# EAGLE design lesion-breakout (EAGLE 8.3.2)
DESIGNER: JON NEWMAN; DESIGN_NAME: lesion-64-128-256; LICENSE: CERN OHL v1.2; REVISION: 1.0
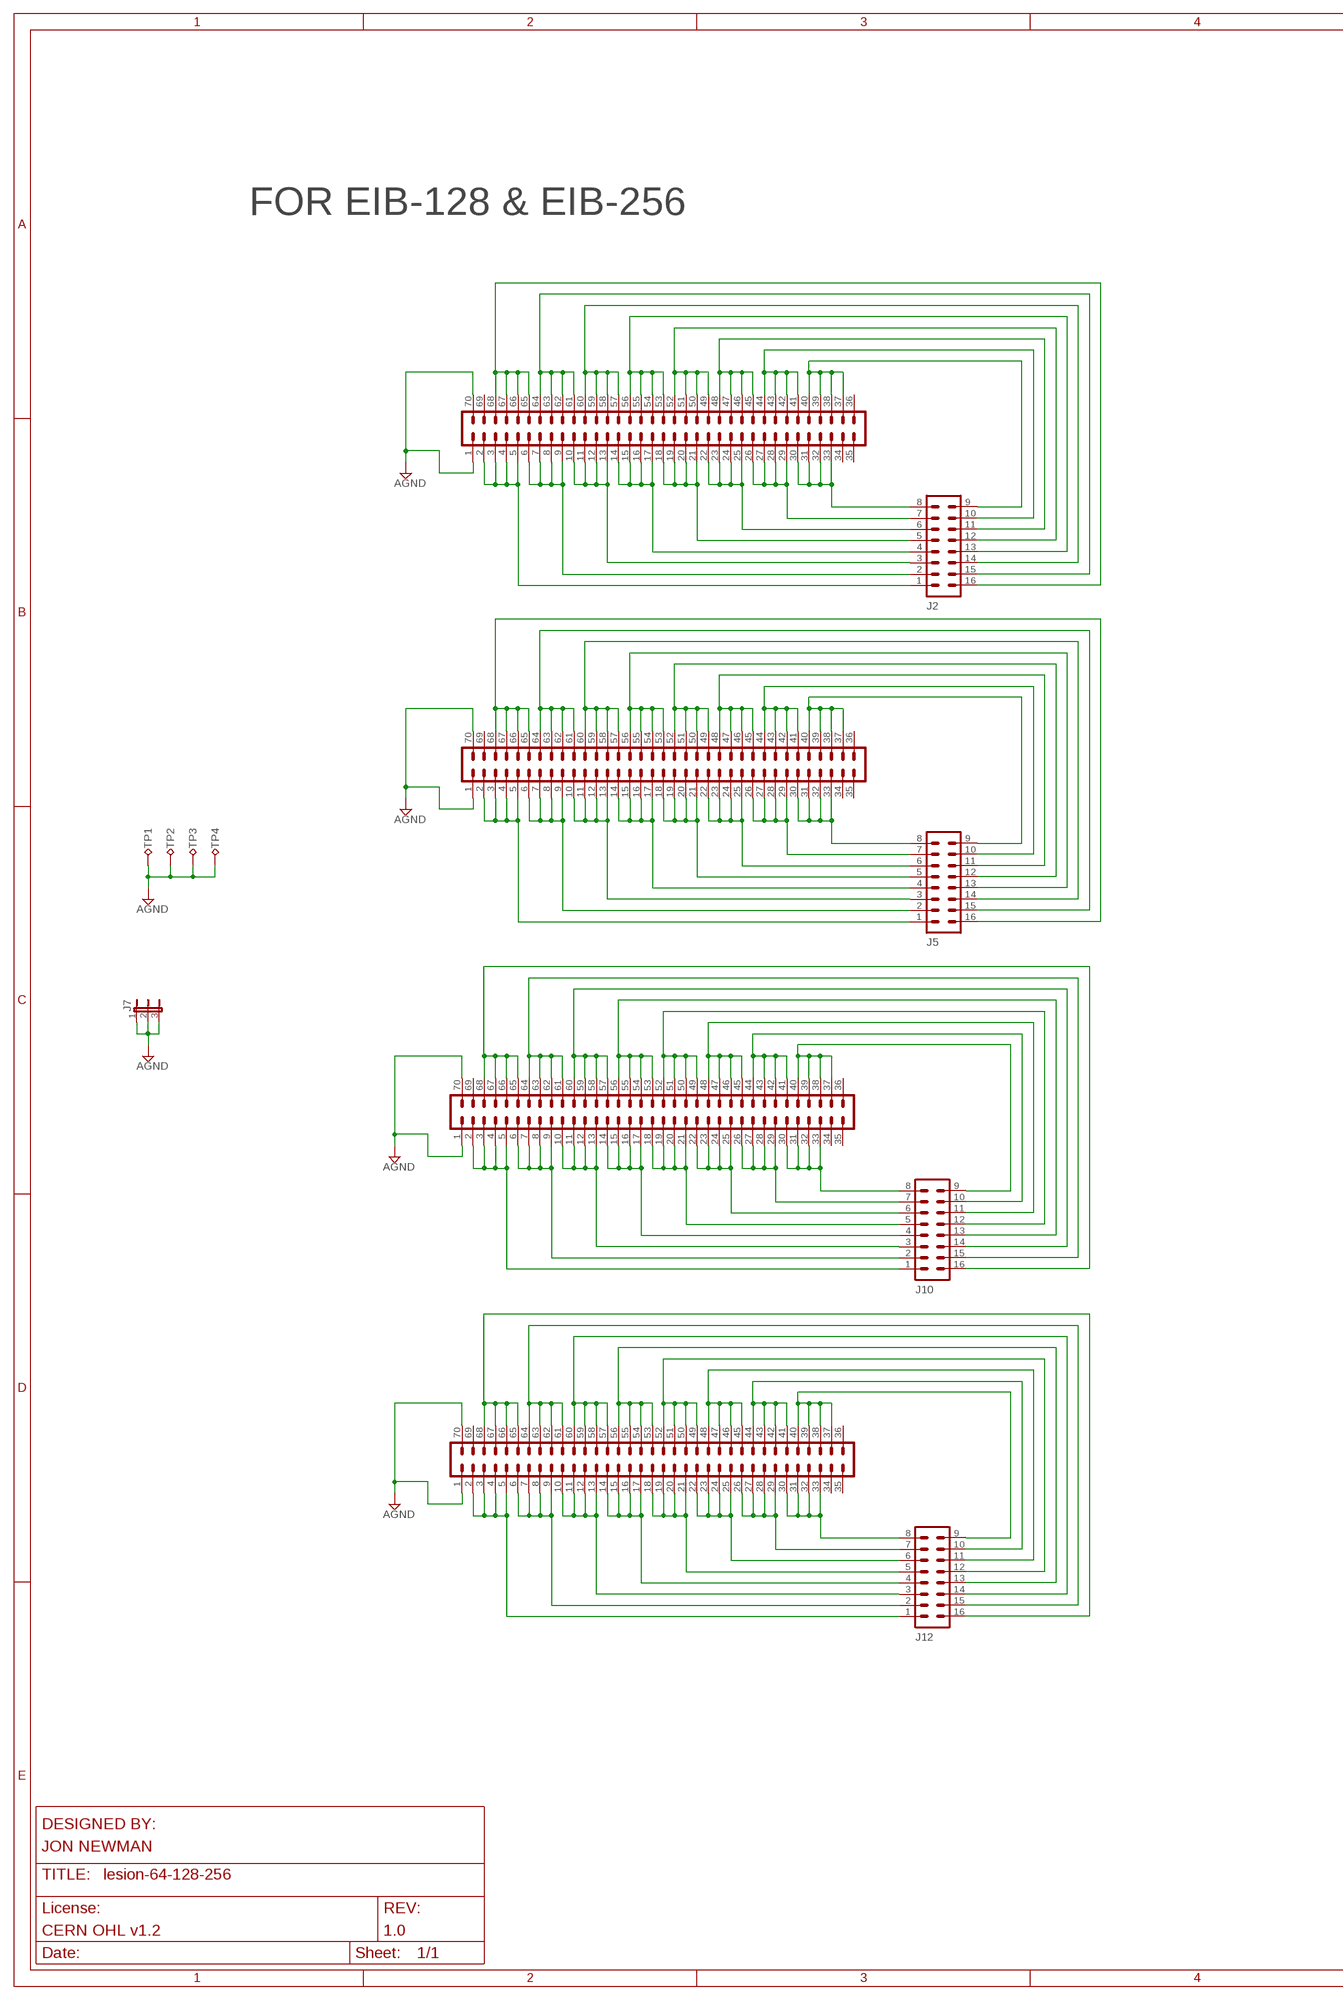
[diagram p0: schematic, sheet 1, part 1 of 3]
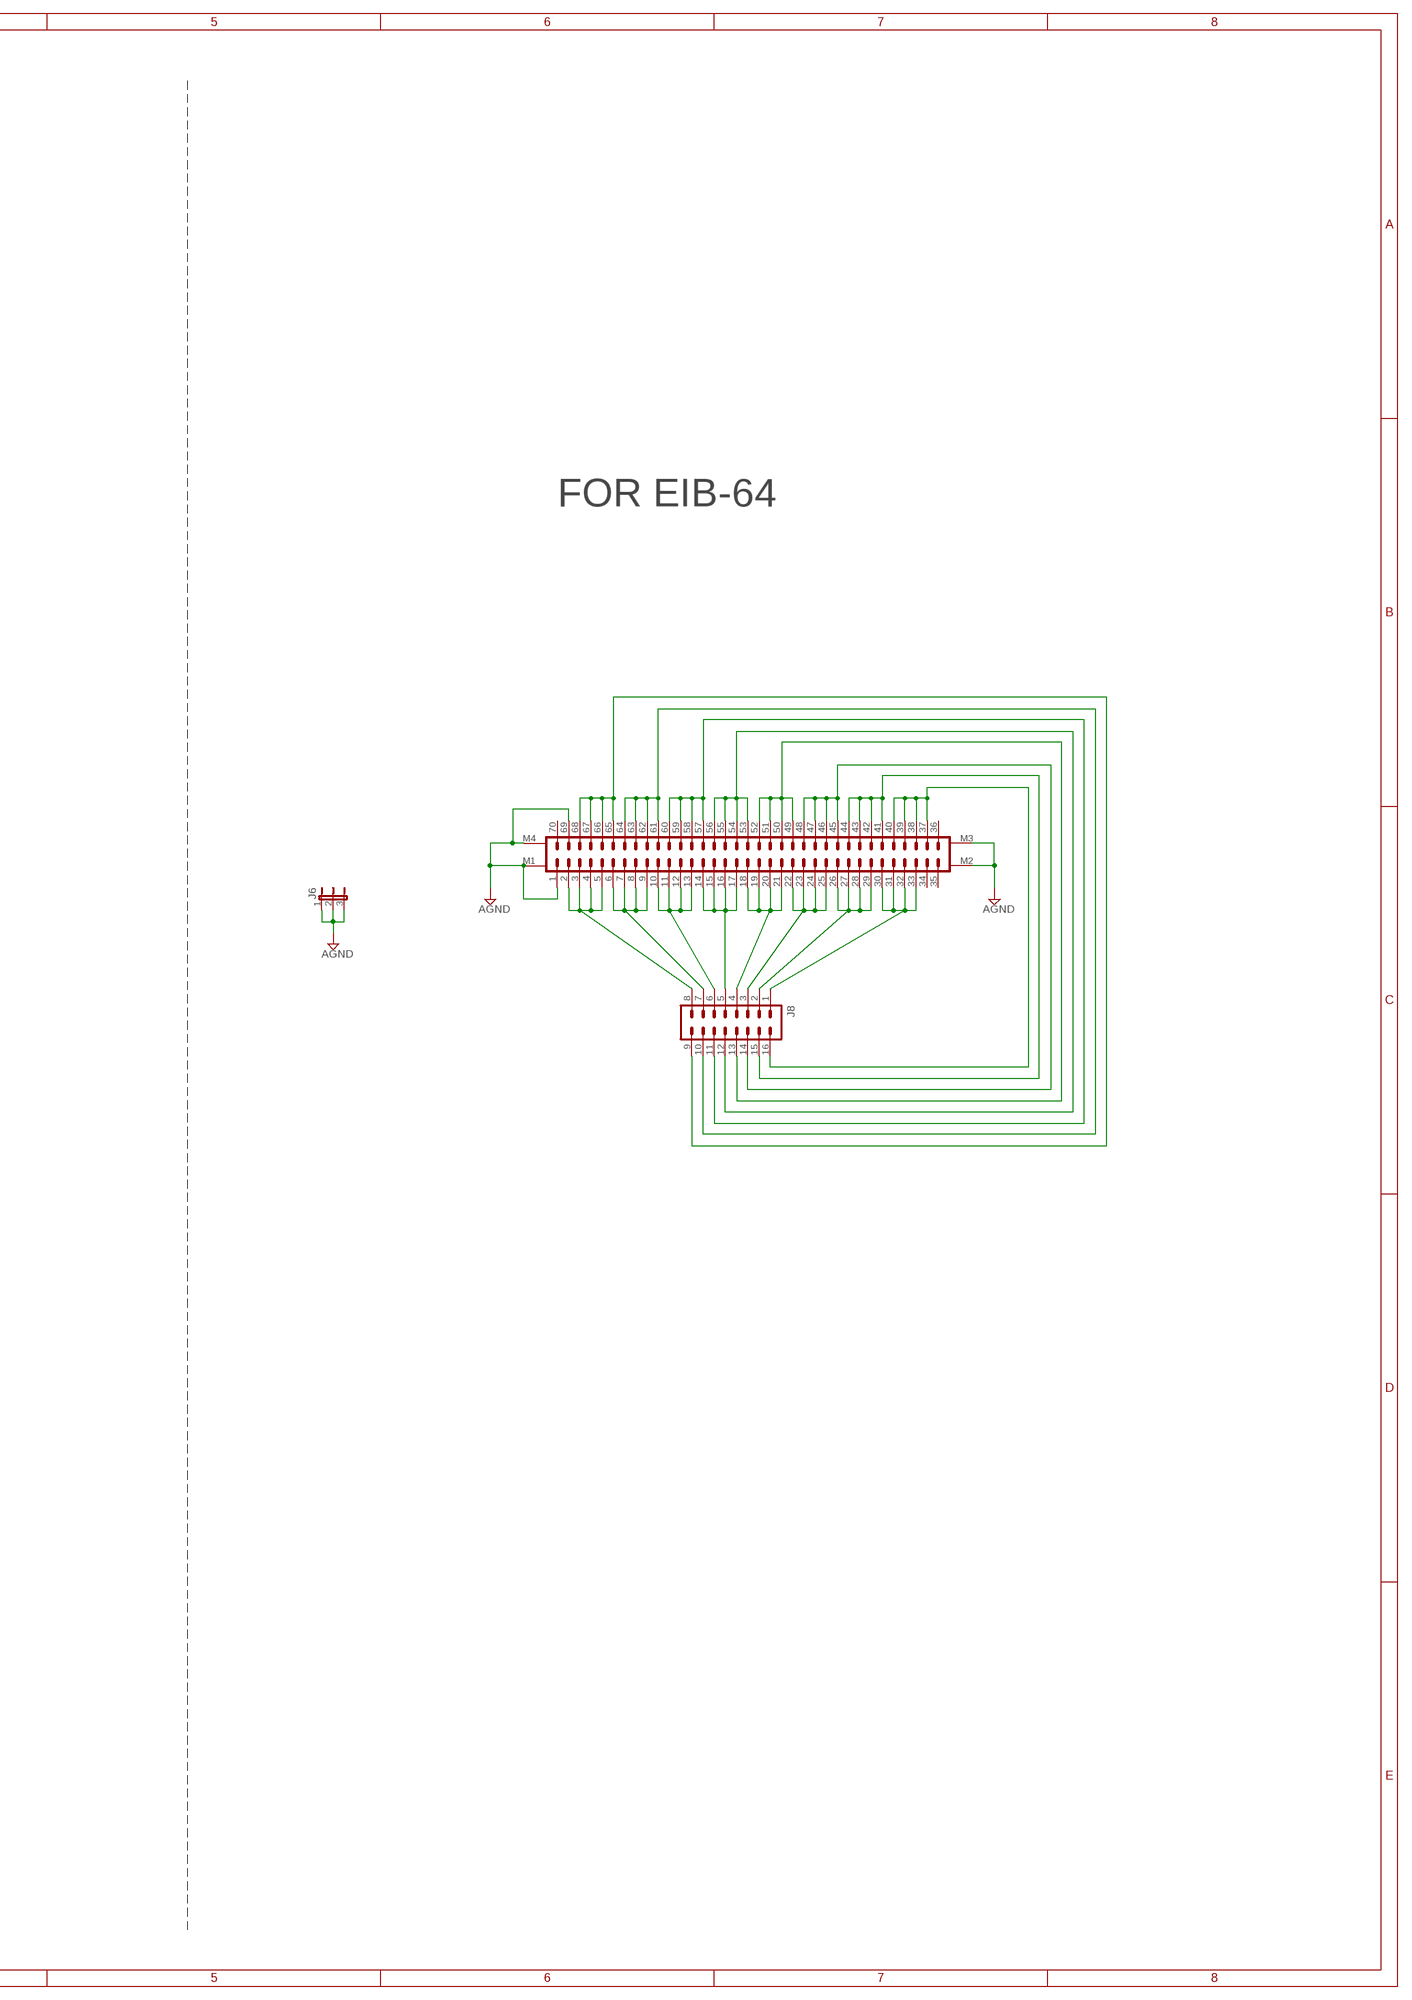
[diagram p1: schematic, sheet 1, part 2 of 3]
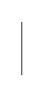
[diagram p2: schematic, sheet 1, part 3 of 3]

## Parts
J1  DF40C(2.0)-70DS-0.4V(51)  PINHD-2X35_DF40REC  [DF40-70REC]
J2  PINHD-2X8_SMD_0.5"  [JP2X8_SMD_0.5"]
J3  DF40C(2.0)-70DS-0.4V(51)  PINHD-2X35_DF40REC  [DF40-70REC]
J4  DF40C-70DP-0.4V(51)  PINHD-2X35+4DF40-70HEAD-LESS-SILK  [DF40-70HEAD-LESS-SILK]
J5  PINHD-2X8_SMD_0.5"  [JP2X8_SMD_0.5"]
J6  JP3E_SMD-0.05  [JP3_SMD-0.05]
J7  JP3E_SMD-0.05  [JP3_SMD-0.05]
J8  PINHD-2X8_SMD_0.5"  [JP2X8_SMD_0.5"]
J9  DF40C(2.0)-70DS-0.4V(51)  PINHD-2X35_DF40REC  [DF40-70REC]
J10  PINHD-2X8_SMD_0.5"  [JP2X8_SMD_0.5"]
J11  DF40C(2.0)-70DS-0.4V(51)  PINHD-2X35_DF40REC  [DF40-70REC]
J12  PINHD-2X8_SMD_0.5"  [JP2X8_SMD_0.5"]
TP1  TP_1MM  [TESTPOINT_1MM]
TP2  TP_1MM  [TESTPOINT_1MM]
TP3  TP_1MM  [TESTPOINT_1MM]
TP4  TP_1MM  [TESTPOINT_1MM]

## Nets
AGND: J1.1 J1.70 J3.1 J3.70 J4.1 J4.69 J4.M1 J4.M2 J4.M3 J4.M4 J6.1 J6.2 J6.3 J7.1 J7.2 J7.3 J9.1 J9.70 J11.1 J11.70 TP1.1(TP) TP2.1(TP) TP3.1(TP) TP4.1(TP)
N$1: J4.53 J4.54 J4.55 J4.56 J8.12
N$2: J4.57 J4.58 J4.59 J4.60 J8.11
N$3: J4.61 J4.62 J4.63 J4.64 J8.10
N$4: J4.2 J4.3 J4.4 J4.5 J8.8
N$5: J4.65 J4.66 J4.67 J4.68 J8.9
N$6: J4.10 J4.11 J4.12 J4.13 J8.6
N$7: J4.14 J4.15 J4.16 J4.17 J8.5
N$8: J4.18 J4.19 J4.20 J4.21 J8.4
N$9: J4.22 J4.23 J4.24 J4.25 J8.3
N$10: J4.26 J4.27 J4.28 J4.29 J8.2
N$11: J4.30 J4.31 J4.32 J4.33 J8.1
N$12: J4.37 J4.38 J4.39 J4.40 J8.16
N$13: J4.41 J4.42 J4.43 J4.44 J8.15
N$14: J4.45 J4.46 J4.47 J4.48 J8.14
N$15: J4.49 J4.50 J4.51 J4.52 J8.13
N$32: J4.6 J4.7 J4.8 J4.9 J8.7
N$33: J1.2 J1.3 J1.4 J1.5 J2.1
N$34: J1.6 J1.7 J1.8 J1.9 J2.2
N$35: J1.10 J1.11 J1.12 J1.13 J2.3
N$36: J1.14 J1.15 J1.16 J1.17 J2.4
N$37: J1.18 J1.19 J1.20 J1.21 J2.5
N$38: J1.22 J1.23 J1.24 J1.25 J2.6
N$39: J1.26 J1.27 J1.28 J1.29 J2.7
N$40: J1.30 J1.31 J1.32 J1.33 J2.8
N$41: J1.37 J1.38 J1.39 J1.40 J2.9
N$42: J1.41 J1.42 J1.43 J1.44 J2.10
N$43: J1.45 J1.46 J1.47 J1.48 J2.11
N$44: J1.49 J1.50 J1.51 J1.52 J2.12
N$45: J1.53 J1.54 J1.55 J1.56 J2.13
N$46: J1.57 J1.58 J1.59 J1.60 J2.14
N$47: J1.61 J1.62 J1.63 J1.64 J2.15
N$48: J1.65 J1.66 J1.67 J1.68 J2.16
N$49: J3.2 J3.3 J3.4 J3.5 J5.1
N$50: J3.6 J3.7 J3.8 J3.9 J5.2
N$51: J3.10 J3.11 J3.12 J3.13 J5.3
N$52: J3.14 J3.15 J3.16 J3.17 J5.4
N$53: J3.18 J3.19 J3.20 J3.21 J5.5
N$54: J3.22 J3.23 J3.24 J3.25 J5.6
N$55: J3.26 J3.27 J3.28 J3.29 J5.7
N$56: J3.30 J3.31 J3.32 J3.33 J5.8
N$57: J3.37 J3.38 J3.39 J3.40 J5.9
N$58: J3.41 J3.42 J3.43 J3.44 J5.10
N$59: J3.45 J3.46 J3.47 J3.48 J5.11
N$60: J3.49 J3.50 J3.51 J3.52 J5.12
N$61: J3.53 J3.54 J3.55 J3.56 J5.13
N$62: J3.57 J3.58 J3.59 J3.60 J5.14
N$63: J3.61 J3.62 J3.63 J3.64 J5.15
N$64: J3.65 J3.66 J3.67 J3.68 J5.16
N$81: J9.2 J9.3 J9.4 J9.5 J10.1
N$82: J9.6 J9.7 J9.8 J9.9 J10.2
N$83: J9.10 J9.11 J9.12 J9.13 J10.3
N$84: J9.14 J9.15 J9.16 J9.17 J10.4
N$85: J9.18 J9.19 J9.20 J9.21 J10.5
N$86: J9.22 J9.23 J9.24 J9.25 J10.6
N$87: J9.26 J9.27 J9.28 J9.29 J10.7
N$88: J9.30 J9.31 J9.32 J9.33 J10.8
N$89: J9.37 J9.38 J9.39 J9.40 J10.9
N$90: J9.41 J9.42 J9.43 J9.44 J10.10
N$91: J9.45 J9.46 J9.47 J9.48 J10.11
N$92: J9.49 J9.50 J9.51 J9.52 J10.12
N$93: J9.53 J9.54 J9.55 J9.56 J10.13
N$94: J9.57 J9.58 J9.59 J9.60 J10.14
N$95: J9.61 J9.62 J9.63 J9.64 J10.15
N$96: J9.65 J9.66 J9.67 J9.68 J10.16
N$113: J11.2 J11.3 J11.4 J11.5 J12.1
N$114: J11.6 J11.7 J11.8 J11.9 J12.2
N$115: J11.10 J11.11 J11.12 J11.13 J12.3
N$116: J11.14 J11.15 J11.16 J11.17 J12.4
N$117: J11.18 J11.19 J11.20 J11.21 J12.5
N$118: J11.22 J11.23 J11.24 J11.25 J12.6
N$119: J11.26 J11.27 J11.28 J11.29 J12.7
N$120: J11.30 J11.31 J11.32 J11.33 J12.8
N$121: J11.37 J11.38 J11.39 J11.40 J12.9
N$122: J11.41 J11.42 J11.43 J11.44 J12.10
N$123: J11.45 J11.46 J11.47 J11.48 J12.11
N$124: J11.49 J11.50 J11.51 J11.52 J12.12
N$125: J11.53 J11.54 J11.55 J11.56 J12.13
N$126: J11.57 J11.58 J11.59 J11.60 J12.14
N$127: J11.61 J11.62 J11.63 J11.64 J12.15
N$128: J11.65 J11.66 J11.67 J11.68 J12.16
Unconnected: J1.34 J1.35 J1.36 J1.69 J3.34 J3.35 J3.36 J3.69 J4.34 J4.35 J4.36 J4.70 J9.34 J9.35 J9.36 J9.69 J11.34 J11.35 J11.36 J11.69

## Notes on the sheet
- FOR EIB-128 & EIB-256
- FOR EIB-64

## Library data of the parts
J1 J3 J9 J11 = jonnew:PINHD-2X35
J2 J5 J8 J10 J12 = jonnew:PINHD-2X8
J4 = jonnew:PINHD-2X35+4
J6 J7 = jonnew:JP3E
TP1-TP4 = jonnew:TP: Test pad

## Net classes
1 thick: width 0.102 mm

## Board
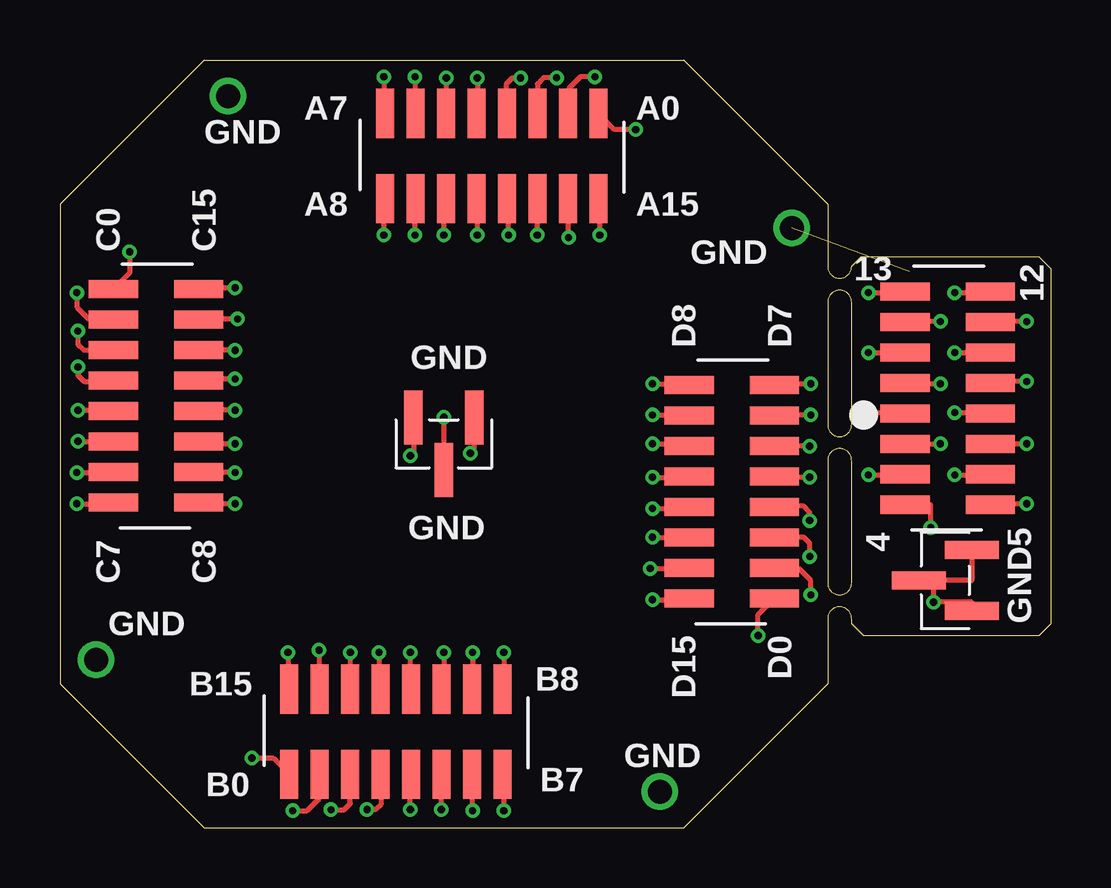
[diagram p3: board, top side]
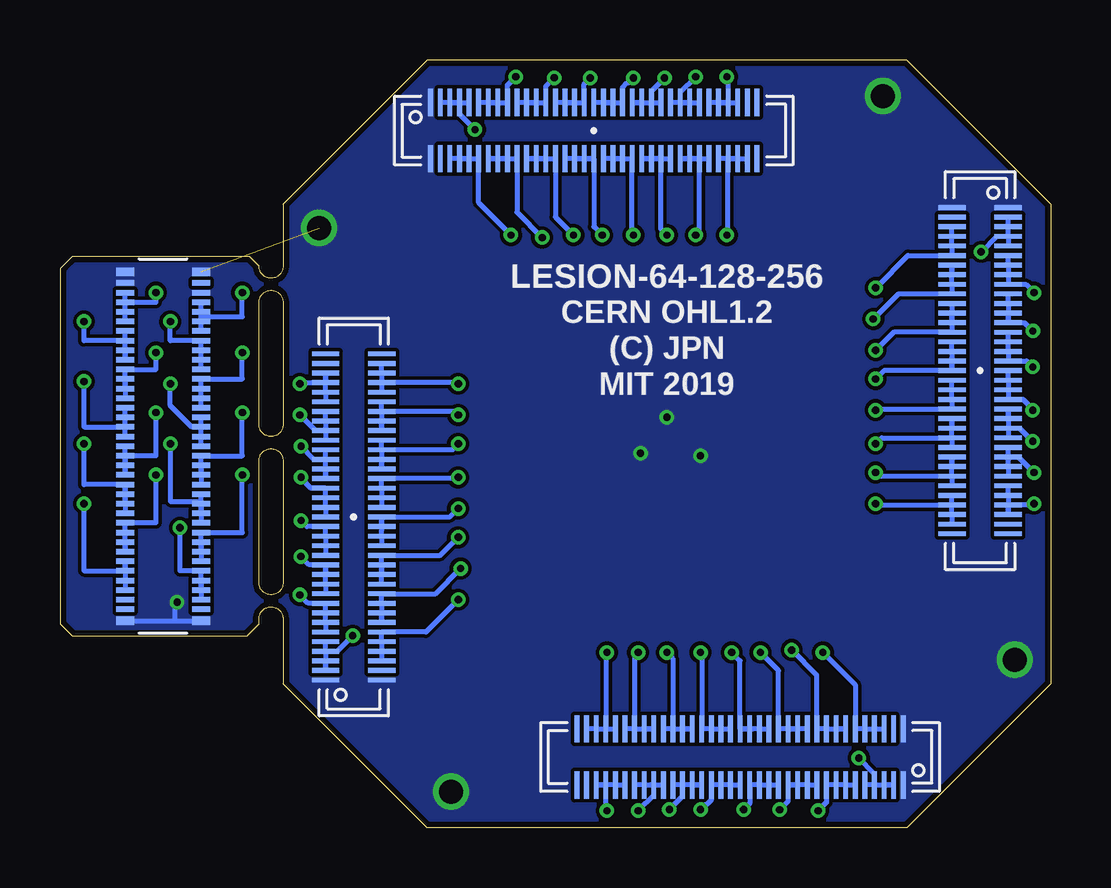
[diagram p4: board, bottom side, seen from below]

Size 41.3 x 32 mm. Coordinates in mm from the lower left corner, seen from the top.
Outline: 32,26 26,32 6,32 0,26 0,6 6,0 26,0 32,6 32,8.7 arc-90 32.5,9.2 arc-90 33,8.7 33,8.5 33.5,8 40.8,8 41.3,8.5 41.3,23.3 40.8,23.8 33.4,23.8 33,23.4 arc-90 32.5,22.9 arc-90 32,23.4 32,26
Outline: 33,21.9 arc90 32.5,22.4 arc90 32,21.9 32,16.8 arc90 32.5,16.3 arc90 33,16.8 33,21.9
Outline: 33,15.3 arc90 32.5,15.8 arc90 32,15.3 32,10.2 arc90 32.5,9.7 arc90 33,10.2 33,15.3
Copper layers (1*16): Top 0.035mm / dielectric 1.5mm / Bottom 0.035mm
Design rules "seeed-studio-2-layer *": minimum track width 6mil, minimum drill 0.3mm, track to track 6mil, track to pad 6mil, pad to pad 6mil, via to via 6mil, smd to smd 0mil, copper to edge 10mil, drill to drill 10mil, minimum pad ring 10mil, minimum via ring 6mil, stop-mask expansion 2mil, vias tented up to drill 100mil, thermal gap 10mil

### Footprints (pad centres in the part's own frame; a part is rotated, then mirrored left to right if it is on the bottom)
DF40-70REC = smd 0.2 x 1.14: 1 -6.8,1.17; 2 -6.4,1.17; 3 -6,1.17; 4 -5.6,1.17; 5 -5.2,1.17; 6 -4.8,1.17; 7 -4.4,1.17; 8 -4,1.17; 9 -3.6,1.17; 10 -3.2,1.17; 11 -2.8,1.17; 12 -2.4,1.17; 13 -2,1.17; 14 -1.6,1.17; 15 -1.2,1.17; 16 -0.8,1.17; 17 -0.4,1.17; 18 0,1.17; 19 0.4,1.17; 20 0.8,1.17; 21 1.2,1.17; 22 1.6,1.17; 23 2,1.17; 24 2.4,1.17; 25 2.8,1.17; 26 3.2,1.17; 27 3.6,1.17; 28 4,1.17; 29 4.4,1.17; 30 4.8,1.17; 31 5.2,1.17; 32 5.6,1.17; 33 6,1.17; 34 6.4,1.17; 35 6.8,1.17; 36 6.8,-1.17; 37 6.4,-1.17; 38 6,-1.17; 39 5.6,-1.17; 40 5.2,-1.17; 41 4.8,-1.17; 42 4.4,-1.17; 43 4,-1.17; 44 3.6,-1.17; 45 3.2,-1.17; 46 2.8,-1.17; 47 2.4,-1.17; 48 2,-1.17; 49 1.6,-1.17; 50 1.2,-1.17; 51 0.8,-1.17; 52 0.4,-1.17; 53 0,-1.17; 54 -0.4,-1.17; 55 -0.8,-1.17; 56 -1.2,-1.17; 57 -1.6,-1.17; 58 -2,-1.17; 59 -2.4,-1.17; 60 -2.8,-1.17; 61 -3.2,-1.17; 62 -3.6,-1.17; 63 -4,-1.17; 64 -4.4,-1.17; 65 -4.8,-1.17; 66 -5.2,-1.17; 67 -5.6,-1.17; 68 -6,-1.17; 69 -6.4,-1.17; 70 -6.8,-1.17
JP2X8_SMD_0.5" = smd 0.76 x 2.05: 1 -4.445,-1.775; 2 -3.175,-1.775; 3 -1.905,-1.775; 4 -0.635,-1.775; 5 0.635,-1.775; 6 1.905,-1.775; 7 3.175,-1.775; 8 4.445,-1.775; 9 4.445,1.775; 10 3.175,1.775; 11 1.905,1.775; 12 0.635,1.775; 13 -0.635,1.775; 14 -1.905,1.775; 15 -3.175,1.775; 16 -4.445,1.775
DF40-70HEAD-LESS-SILK = smd 0.23 x 0.75: 1 -6.8,-1.585; 2 -6.4,-1.585; 3 -6,-1.585; 4 -5.6,-1.585; 5 -5.2,-1.585; 6 -4.8,-1.585; 7 -4.4,-1.585; 8 -4,-1.585; 9 -3.6,-1.585; 10 -3.2,-1.585; 11 -2.8,-1.585; 12 -2.4,-1.585; 13 -2,-1.585; 14 -1.6,-1.585; 15 -1.2,-1.585; 16 -0.8,-1.585; 17 -0.4,-1.585; 18 0,-1.585; 19 0.4,-1.585; 20 0.8,-1.585; 21 1.2,-1.585; 22 1.6,-1.585; 23 2,-1.585; 24 2.4,-1.585; 25 2.8,-1.585; 26 3.2,-1.585; 27 3.6,-1.585; 28 4,-1.585; 29 4.4,-1.585; 30 4.8,-1.585; 31 5.2,-1.585; 32 5.6,-1.585; 33 6,-1.585; 34 6.4,-1.585; 35 6.8,-1.585; 36 6.8,1.585; 37 6.4,1.585; 38 6,1.585; 39 5.6,1.585; 40 5.2,1.585; 41 4.8,1.585; 42 4.4,1.585; 43 4,1.585; 44 3.6,1.585; 45 3.2,1.585; 46 2.8,1.585; 47 2.4,1.585; 48 2,1.585; 49 1.6,1.585; 50 1.2,1.585; 51 0.8,1.585; 52 0.4,1.585; 53 0,1.585; 54 -0.4,1.585; 55 -0.8,1.585; 56 -1.2,1.585; 57 -1.6,1.585; 58 -2,1.585; 59 -2.4,1.585; 60 -2.8,1.585; 61 -3.2,1.585; 62 -3.6,1.585; 63 -4,1.585; 64 -4.4,1.585; 65 -4.8,1.585; 66 -5.2,1.585; 67 -5.6,1.585; 68 -6,1.585; 69 -6.4,1.585; 70 -6.8,1.585 | smd 0.35 x 0.75: M1 -7.275,-1.585; M2 7.275,-1.585; M3 7.275,1.585; M4 -7.275,1.585
JP3_SMD-0.05 = smd 0.76 x 2.25: 1 -1.27,1.1; 2 0,-1.1; 3 1.27,1.1
TESTPOINT_1MM = drill 1: 1 0,0

### Placement (x,y rotation side)
J1  19.05,29.05 0 bottom
J2  18,28 180 top
J3  2.95,19.05 270 bottom
J4  37,15.9 270 bottom
J5  4,18 270 top
J6  36.9,10.3 270 top
J7  16,16 0 top
J8  37,17.9 90 top
J9  12.95,2.95 180 bottom
J10  14,4 0 top
J11  29.05,12.95 90 bottom
J12  28,14 90 top
TP1  1.5,7 0 top
TP2  7,30.5 0 top
TP3  30.5,25 0 top
TP4  25,1.5 0 top

### Tracks (layer width: path | path; a pad name or v marks a point on that pad's centre or on a via)
AGND  (via drill 0.3)  (1 unrouted)
  Top 0.2: J7.2 v16,17.1 | J7.1 14.73,15.63 v14.6,15.5 | J7.3 17.27,15.77 v17.1,15.6 | J6.3 38,9.4 v36.42,9.4 36.42,10.3 | 36.42,10.3 J6.2 | J6.1 38,10.3 36.42,10.3
  Bottom 0.2: J4.M2 J4.M3 | 36.5,8.62 36.5,9.4 v36.42,9.4
  pour Bottom (no thermals): -11.7,42.3 51.3,42.3 51.3,-19 -12,-19
N$1  (via drill 0.3)
  Top 0.2: v36.7,18.5 35.23,18.5 J8.12
  Bottom 0.2: v36.7,18.5 36.7,17.59 35.81,16.7 J4.55 | J4.53 35.41,16.6 | J4.55 J4.56 | J4.54 35.41,16.6 | 35.41,16.6 J4.55
N$2  (via drill 0.3)
  Top 0.2: v33.7,19.8 J8.11
  Bottom 0.2: v33.7,19.8 33.7,18.7 J4.60 J4.59 J4.58 J4.57
N$3  (via drill 0.3)
  Top 0.2: v36.7,21.1 35.23,21.1 J8.10
  Bottom 0.2: v36.7,21.1 36.7,20.3 J4.64 J4.63 J4.62 J4.61
N$4  (via drill 0.3)
  Top 0.2: v37.3,22.3 38.77,22.3 J8.8
  Bottom 0.2: J4.3 J4.4 J4.5 | J4.3 J4.2 | J4.3 37.3,21.9 v37.3,22.3
N$5  (via drill 0.3)
  Top 0.2: v33.7,22.3 35.23,22.3 J8.9
  Bottom 0.2: J4.65 35.41,21.3 | 35.41,21.4 35.41,21.3 | 35.41,21.6 35.41,21.4 | 35.41,21.6 J4.68 | 35.41,21.3 33.7,21.3 v33.7,22.3 | J4.66 35.41,21.4 | J4.67 35.41,21.6
N$6  (via drill 0.3)
  Top 0.2: v37.3,19.8 J8.6
  Bottom 0.2: 38.59,18.6 J4.10 | 38.59,18.6 J4.13 | J4.10 37.3,19.1 v37.3,19.8 | J4.11 J4.10 | J4.12 38.59,18.6
N$7  (via drill 0.3)
  Top 0.2: v40.3,18.6 38.77,18.6 J8.5
  Bottom 0.2: J4.17 J4.15 | v40.3,18.6 40.3,16.7 J4.16 J4.15 | J4.15 J4.14
N$8  (via drill 0.3)
  Top 0.2: v37.3,17.3 38.77,17.3 J8.4
  Bottom 0.2: 38.59,15.4 J4.21 J4.20 38.59,15.4 | 38.59,15.4 J4.18 | v37.3,17.3 37.3,15.5 J4.19 38.59,15.4
N$9  (via drill 0.3)
  Top 0.2: v40.3,16 J8.3
  Bottom 0.2: 38.59,13.6 J4.22 | 38.59,13.6 J4.25 | J4.22 40.3,14.3 v40.3,16 | J4.22 J4.23 38.59,13.6 | J4.24 38.59,13.6
N$10  (via drill 0.3)
  Top 0.2: v37.3,14.7 38.77,14.7 | 39.5,14.7 38.77,14.7 | 38.77,14.7 J8.2
  Bottom 0.2: v37.3,14.7 37.3,12.7 J4.26 J4.27 J4.29 J4.28
N$11  (via drill 0.3)
  Top 0.2: v40.3,13.5 38.77,13.5 J8.1
  Bottom 0.2: J4.33 J4.32 J4.30 J4.31 40.3,10.7 v40.3,13.5
N$12  (via drill 0.3)
  Top 0.2: v36.3,12.5 36.3,13.46 J8.16
  Bottom 0.2: v36.3,12.5 36.3,10.7 J4.40 35.41,10.4 | 35.41,10.2 J4.37 | 35.41,10.4 35.41,10.2 | J4.38 35.41,10.2 | J4.39 35.41,10.4
N$13  (via drill 0.3)
  Top 0.2: v33.7,14.7 35.23,14.7 J8.15
  Bottom 0.2: v33.7,14.7 33.7,12.3 J4.44 35.41,11.8 | 35.41,11.7 35.41,11.8 | 35.41,11.7 J4.41 | J4.42 35.41,11.7 | 35.41,11.7 35.41,11.8 | J4.43 35.41,11.7
N$14  (via drill 0.3)
  Top 0.2: J8.14 v36.7,15.99 v36.7,16
  Bottom 0.2: 35.41,13.6 J4.45 | 35.41,13.6 J4.48 | v36.7,16 36.7,13.6 35.41,13.6 | J4.46 35.41,13.6 | J4.47 35.41,13.6
N$15  (via drill 0.3)
  Top 0.2: v33.7,17.3 35.23,17.3 J8.13
  Bottom 0.2: v33.7,17.3 33.7,15.5 J4.52 35.41,15.2 | J4.51 35.41,14.8 | J4.51 35.41,15.2 | 35.41,14.8 J4.49 | 35.41,15.2 J4.51 | J4.51 35.41,14.8 | J4.50 J4.51
N$32  (via drill 0.3)
  Top 0.2: v40.3,21.1 38.77,21.1 J8.7
  Bottom 0.2: J4.7 J4.6 | J4.7 40.3,20.3 v40.3,21.1 | J4.7 J4.9 J4.8
N$33  (via drill 0.3)
  Top 0.2: v24,29.1 23.12,29.1 J2.1
  Bottom 0.2: 24.7,30.23 25,30.23 | 24.7,30.23 J1.5 | 25,30.23 J1.2 | v24,29.1 24.65,29.75 J1.4 24.7,30.23 | 24.7,30.23 25,30.23 | J1.3 24.7,30.23
N$34  (via drill 0.3)
  Top 0.2: v22.3,31.3 21.7,31.3 21.2,30.8 21.2,29.8 J2.2
  Bottom 0.2: J1.9 22.65,30.95 v22.3,31.3 | 23,30.23 J1.6 | 23,30.23 J1.9 | J1.7 23,30.23 | J1.8 J1.9
N$35  (via drill 0.3)
  Top 0.2: v20.7,31.26 20.16,31.26 19.9,31 J2.3
  Bottom 0.2: 21.8,30.23 21.5,30.23 | 21.8,30.23 J1.10 | 21.5,30.23 J1.13 21.05,30.91 v20.7,31.26 | J1.11 21.8,30.23 | 21.8,30.23 21.5,30.23 | J1.12 21.8,30.23
N$36  (via drill 0.3)
  Top 0.2: v19.2,31.25 18.85,31.25 18.6,31 18.6,29.81 J2.4
  Bottom 0.2: v19.2,31.25 19.45,31 J1.17 19.8,30.23 | 20.2,30.23 19.8,30.23 | 20.2,30.23 J1.14 | J1.15 20.2,30.23 | 20.2,30.23 19.8,30.23 | J1.16 20.2,30.23
N$37  (via drill 0.3)
  Top 0.2: v17.4,31.25 17.4,29.81 J2.5
  Bottom 0.2: v17.4,31.25 17.6,31.05 17.66,31.05 17.85,30.85 J1.21 18.2,30.23 | 18.3,30.23 J1.18 | 18.2,30.23 18.3,30.23 | J1.19 18.3,30.23 | J1.20 18.2,30.23
N$38  (via drill 0.3)
  Top 0.2: v16.1,31.25 J2.6
  Bottom 0.2: J1.24 16.65,30.7 v16.1,31.25 | J1.24 J1.25 | J1.24 J1.22 J1.23
N$39  (via drill 0.3)
  Top 0.2: v14.8,31.3 14.8,29.8 J2.7
  Bottom 0.2: v14.8,31.3 15.45,30.65 J1.27 15.5,30.23 | 15.3,30.23 J1.29 | 15.5,30.23 15.3,30.23 | 15.5,30.23 J1.26 | J1.28 15.3,30.23
N$40  (via drill 0.3)
  Top 0.2: v13.5,31.3 13.5,29.83 J2.8
  Bottom 0.2: v13.5,31.3 13.45,31.25 J1.32 13.8,30.23 | 13.8,30.23 13.5,30.23 | 13.8,30.23 J1.30 | 13.5,30.23 J1.33 | J1.31 13.8,30.23 | 13.8,30.23 13.5,30.23
N$41  (via drill 0.3)
  Top 0.2: v13.5,24.7 13.5,26.17 J2.9
  Bottom 0.2: v13.5,24.7 13.45,24.75 J1.39 13.5,27.88 | 13.4,27.88 J1.37 | 13.5,27.88 13.4,27.88 | 13.5,27.88 J1.40 | J1.38 13.4,27.88
N$42  (via drill 0.3)
  Top 0.2: v14.8,24.7 14.8,26.2 J2.10
  Bottom 0.2: 15,27.88 J1.41 | 15,27.88 J1.44 J1.43 | v14.8,24.7 14.65,24.85 J1.42 15,27.88
N$43  (via drill 0.3)
  Top 0.2: v16,24.7 16,26.5 16.3,26.8 16.3,26.43 J2.11
  Bottom 0.2: 16.7,27.88 J1.45 | 16.7,27.88 J1.48 J1.47 | v16,24.7 16.25,24.95 J1.46 16.7,27.88
N$44  (via drill 0.3)
  Top 0.2: v17.4,24.7 17.4,26.19 J2.12
  Bottom 0.2: v17.4,24.7 17.45,24.75 J1.49 17.8,27.88 | 17.8,27.88 18.2,27.88 | 18.2,27.88 J1.52 | J1.50 18.2,27.88 | J1.51 17.8,27.88
N$45  (via drill 0.3)
  Top 0.2: v18.7,24.7 18.7,26.16 J2.13
  Bottom 0.2: 19.6,27.88 J1.56 | J1.53 19.6,27.88 | J1.53 19.05,25.05 v18.7,24.7 | J1.55 19.6,27.88 | J1.54 J1.53
N$46  (via drill 0.3)
  Top 0.2: v19.9,24.7 J2.14
  Bottom 0.2: v19.9,24.7 20.65,25.45 J1.57 J1.59 | J1.59 J1.60 J1.59 | J1.58 J1.59
N$47  (via drill 0.3)
  Top 0.2: v21.2,24.6 21.2,26.2 J2.15
  Bottom 0.2: v21.2,24.6 22.25,25.65 J1.61 23.1,27.88 | 23.1,27.88 J1.64 J1.63 | J1.62 23.1,27.88
N$48  (via drill 0.3)
  Top 0.2: v22.5,24.7 22.5,26.17 J2.16
  Bottom 0.2: v22.5,24.7 23.85,26.05 J1.65 24.2,27.88 | 24.2,27.88 24.6,27.88 | 24.6,27.88 J1.68 | J1.66 24.6,27.88 | J1.67 24.2,27.88
N$49  (via drill 0.3)
  Top 0.2: v2.9,24 2.9,23.12 J5.1
  Bottom 0.2: J3.4 J3.5 | 1.78,25 J3.2 | J3.4 2.25,24.65 v2.9,24 | J3.4 1.78,24.7 1.78,25 | J3.3 1.78,25
N$50  (via drill 0.3)
  Top 0.2: v0.7,22.3 0.7,21.7 1.2,21.2 2.2,21.2 J5.2
  Bottom 0.2: J3.9 1.05,22.65 v0.7,22.3 | J3.6 J3.7 1.78,23 J3.9 | J3.8 J3.9
N$51  (via drill 0.3)
  Top 0.2: v0.74,20.7 0.74,20.16 1,19.9 J5.3
  Bottom 0.2: J3.10 J3.11 1.78,21.8 J3.12 J3.13 | J3.13 1.78,21.5 | J3.13 1.1,21.05 v0.74,20.7
N$52  (via drill 0.3)
  Top 0.2: v0.75,19.2 0.75,18.85 1,18.6 2.19,18.6 J5.4
  Bottom 0.2: v0.75,19.2 1,19.45 J3.17 1.78,19.8 J3.16 1.78,20.2 J3.15 J3.14
N$53  (via drill 0.3)
  Top 0.2: v0.75,17.4 2.19,17.4 J5.5
  Bottom 0.2: v0.75,17.4 0.95,17.6 0.95,17.66 1.15,17.85 J3.21 1.78,18.2 J3.20 1.78,18.3 J3.19 J3.18
N$54  (via drill 0.3)
  Top 0.2: v0.75,16.1 J5.6
  Bottom 0.2: J3.24 1.3,16.65 v0.75,16.1 | J3.24 J3.25 | J3.24 J3.22 J3.23
N$55  (via drill 0.3)
  Top 0.2: v0.7,14.8 2.2,14.8 J5.7
  Bottom 0.2: J3.27 1.35,15.45 v0.7,14.8 | J3.29 J3.28 1.78,15.3 J3.27 | J3.26 1.78,15.5 J3.27
N$56  (via drill 0.3)
  Top 0.2: v0.7,13.5 2.17,13.5 J5.8
  Bottom 0.2: J3.32 0.75,13.45 v0.7,13.5 | J3.30 J3.31 1.78,13.8 J3.32 | 1.78,13.5 J3.33 J3.32
N$57  (via drill 0.3)
  Top 0.2: v7.3,13.5 5.83,13.5 J5.9
  Bottom 0.2: J3.39 7.25,13.45 v7.3,13.5 | J3.37 J3.38 4.12,13.4 J3.39 | J3.40 4.12,13.5 J3.39
N$58  (via drill 0.3)
  Top 0.2: v7.3,14.8 5.8,14.8 J5.10
  Bottom 0.2: J3.42 J3.41 | J3.42 7.15,14.65 v7.3,14.8 | J3.42 4.12,15 J3.44 J3.43
N$59  (via drill 0.3)
  Top 0.2: v7.3,16 5.5,16 5.2,16.3 5.57,16.3 J5.11
  Bottom 0.2: J3.46 J3.45 | J3.46 7.05,16.25 v7.3,16 | J3.46 4.12,16.7 J3.48 J3.47
N$60  (via drill 0.3)
  Top 0.2: v7.3,17.4 5.81,17.4 J5.12
  Bottom 0.2: v7.3,17.4 7.25,17.45 J3.49 4.12,17.8 J3.50 4.12,18.2 | 4.12,18.2 J3.52 | J3.51 4.12,18.2
N$61  (via drill 0.3)
  Top 0.2: v7.3,18.7 5.84,18.7 J5.13
  Bottom 0.2: J3.56 J3.55 4.12,19.6 J3.53 | J3.53 6.95,19.05 v7.3,18.7 | J3.54 J3.53
N$62  (via drill 0.3)
  Top 0.2: v7.3,19.9 J5.14
  Bottom 0.2: v7.3,19.9 6.55,20.65 J3.57 J3.59 | J3.60 J3.59 | J3.58 J3.59
N$63  (via drill 0.3)
  Top 0.2: v7.4,21.2 5.8,21.2 J5.15
  Bottom 0.2: v7.4,21.2 6.35,22.25 J3.61 J3.62 4.12,23.1 J3.64 J3.63
N$64  (via drill 0.3)
  Top 0.2: v7.3,22.5 5.83,22.5 J5.16
  Bottom 0.2: v7.3,22.5 5.95,23.85 J3.65 4.12,24.2 J3.66 4.12,24.6 | 4.12,24.6 J3.68 | J3.67 4.12,24.6
N$81  (via drill 0.3)
  Top 0.2: v8,2.9 8.88,2.9 J10.1
  Bottom 0.2: J9.4 J9.5 | 7,1.78 J9.2 J9.3 7.3,1.78 J9.4 | J9.4 7.35,2.25 v8,2.9
N$82  (via drill 0.3)
  Top 0.2: v9.7,0.7 10.3,0.7 10.8,1.2 10.8,2.2 J10.2
  Bottom 0.2: J9.9 9.35,1.05 v9.7,0.7 | J9.6 J9.7 9,1.78 J9.9 | J9.8 J9.9
N$83  (via drill 0.3)
  Top 0.2: v11.3,0.74 11.84,0.74 12.1,1 J10.3
  Bottom 0.2: J9.10 J9.11 10.2,1.78 J9.12 J9.13 | J9.13 10.5,1.78 | J9.13 10.95,1.1 v11.3,0.74
N$84  (via drill 0.3)
  Top 0.2: v12.8,0.75 13.15,0.75 13.4,1 13.4,2.19 J10.4
  Bottom 0.2: v12.8,0.75 12.55,1 J9.17 12.2,1.78 J9.16 11.8,1.78 J9.15 J9.14
N$85  (via drill 0.3)
  Top 0.2: v14.6,0.75 14.6,2.19 J10.5
  Bottom 0.2: v14.6,0.75 14.4,0.95 14.35,0.95 14.15,1.15 J9.21 13.8,1.78 J9.20 13.7,1.78 J9.19 J9.18
N$86  (via drill 0.3)
  Top 0.2: v15.9,0.75 J10.6
  Bottom 0.2: J9.24 15.35,1.3 v15.9,0.75 | J9.24 J9.25 | J9.24 J9.22 J9.23
N$87  (via drill 0.3)
  Top 0.2: v17.2,0.7 17.2,2.2 J10.7
  Bottom 0.2: J9.27 16.55,1.35 v17.2,0.7 | J9.29 J9.28 16.7,1.78 J9.27 | J9.26 16.5,1.78 J9.27
N$88  (via drill 0.3)
  Top 0.2: v18.5,0.7 18.5,2.17 J10.8
  Bottom 0.2: J9.32 18.55,0.75 v18.5,0.7 | J9.30 J9.31 18.2,1.78 J9.32 | 18.5,1.78 J9.33 J9.32
N$89  (via drill 0.3)
  Top 0.2: v18.5,7.3 18.5,5.83 J10.9
  Bottom 0.2: J9.39 18.55,7.25 v18.5,7.3 | J9.37 J9.38 18.6,4.12 J9.39 | J9.40 18.5,4.12 J9.39
N$90  (via drill 0.3)
  Top 0.2: v17.2,7.3 17.2,5.8 J10.10
  Bottom 0.2: J9.42 J9.41 | J9.42 17.35,7.15 v17.2,7.3 | J9.42 17,4.12 J9.44 J9.43
N$91  (via drill 0.3)
  Top 0.2: v16,7.3 16,5.5 15.7,5.2 15.7,5.57 J10.11
  Bottom 0.2: J9.46 J9.45 | J9.46 15.75,7.05 v16,7.3 | J9.46 15.3,4.12 J9.48 J9.47
N$92  (via drill 0.3)
  Top 0.2: v14.6,7.3 14.6,5.81 J10.12
  Bottom 0.2: v14.6,7.3 14.55,7.25 J9.49 14.2,4.12 J9.50 13.8,4.12 | 13.8,4.12 J9.52 | J9.51 13.8,4.12
N$93  (via drill 0.3)
  Top 0.2: v13.3,7.3 13.3,5.84 J10.13
  Bottom 0.2: J9.56 J9.55 12.4,4.12 J9.53 | J9.53 12.95,6.95 v13.3,7.3 | J9.54 J9.53
N$94  (via drill 0.3)
  Top 0.2: v12.1,7.3 J10.14
  Bottom 0.2: v12.1,7.3 11.35,6.55 J9.57 J9.59 | J9.60 J9.59 | J9.58 J9.59
N$95  (via drill 0.3)
  Top 0.2: v10.8,7.4 10.8,5.8 J10.15
  Bottom 0.2: v10.8,7.4 9.75,6.35 J9.61 J9.62 8.9,4.12 J9.64 J9.63
N$96  (via drill 0.3)
  Top 0.2: v9.5,7.3 9.5,5.83 J10.16
  Bottom 0.2: v9.5,7.3 8.15,5.95 J9.65 7.8,4.12 J9.66 7.4,4.12 | 7.4,4.12 J9.68 | J9.67 7.4,4.12
N$113  (via drill 0.3)
  Top 0.2: v29.1,8 29.1,8.88 J12.1
  Bottom 0.2: J11.4 J11.5 | 30.23,7 J11.2 J11.3 30.23,7.3 J11.4 | J11.4 29.75,7.35 v29.1,8
N$114  (via drill 0.3)
  Top 0.2: v31.3,9.7 31.3,10.3 30.8,10.8 29.8,10.8 J12.2
  Bottom 0.2: J11.9 30.95,9.35 v31.3,9.7 | J11.6 J11.7 30.23,9 J11.9 | J11.8 J11.9
N$115  (via drill 0.3)
  Top 0.2: v31.26,11.3 31.26,11.84 31,12.1 J12.3
  Bottom 0.2: J11.10 J11.11 30.23,10.2 J11.12 J11.13 | J11.13 30.23,10.5 | J11.13 30.91,10.95 v31.26,11.3
N$116  (via drill 0.3)
  Top 0.2: v31.25,12.8 31.25,13.15 31,13.4 29.81,13.4 J12.4
  Bottom 0.2: v31.25,12.8 31,12.55 J11.17 30.23,12.2 J11.16 30.23,11.8 J11.15 J11.14
N$117  (via drill 0.3)
  Top 0.2: v31.25,14.6 29.81,14.6 J12.5
  Bottom 0.2: v31.25,14.6 31.05,14.4 31.05,14.35 30.85,14.15 J11.21 30.23,13.8 J11.20 30.23,13.7 J11.19 J11.18
N$118  (via drill 0.3)
  Top 0.2: v31.25,15.9 J12.6
  Bottom 0.2: J11.24 30.7,15.35 v31.25,15.9 | J11.24 J11.25 | J11.24 J11.22 J11.23
N$119  (via drill 0.3)
  Top 0.2: v31.3,17.2 29.8,17.2 J12.7
  Bottom 0.2: J11.27 30.65,16.55 v31.3,17.2 | J11.29 J11.28 30.23,16.7 J11.27 | J11.26 30.23,16.5 J11.27
N$120  (via drill 0.3)
  Top 0.2: v31.3,18.5 29.83,18.5 J12.8
  Bottom 0.2: J11.32 31.25,18.55 v31.3,18.5 | J11.30 J11.31 30.23,18.2 J11.32 | 30.23,18.5 J11.33 J11.32
N$121  (via drill 0.3)
  Top 0.2: v24.7,18.5 26.17,18.5 J12.9
  Bottom 0.2: J11.39 24.75,18.55 v24.7,18.5 | J11.37 J11.38 27.88,18.6 J11.39 | J11.40 27.88,18.5 J11.39
N$122  (via drill 0.3)
  Top 0.2: v24.7,17.2 26.2,17.2 J12.10
  Bottom 0.2: J11.42 J11.41 | J11.42 24.85,17.35 v24.7,17.2 | J11.42 27.88,17 J11.44 J11.43
N$123  (via drill 0.3)
  Top 0.2: v24.7,16 26.5,16 26.8,15.7 26.43,15.7 J12.11
  Bottom 0.2: J11.46 J11.45 | J11.46 24.95,15.75 v24.7,16 | J11.46 27.88,15.3 J11.48 J11.47
N$124  (via drill 0.3)
  Top 0.2: v24.7,14.6 26.19,14.6 J12.12
  Bottom 0.2: v24.7,14.6 24.75,14.55 J11.49 27.88,14.2 J11.50 27.88,13.8 | 27.88,13.8 J11.52 | J11.51 27.88,13.8
N$125  (via drill 0.3)
  Top 0.2: v24.7,13.3 26.16,13.3 J12.13
  Bottom 0.2: J11.56 J11.55 27.88,12.4 J11.53 | J11.53 25.05,12.95 v24.7,13.3 | J11.54 J11.53
N$126  (via drill 0.3)
  Top 0.2: v24.7,12.1 J12.14
  Bottom 0.2: v24.7,12.1 25.45,11.35 J11.57 J11.59 | J11.60 J11.59 | J11.58 J11.59
N$127  (via drill 0.3)
  Top 0.2: v24.6,10.8 26.2,10.8 J12.15
  Bottom 0.2: v24.6,10.8 25.65,9.75 J11.61 J11.62 27.88,8.9 J11.64 J11.63
N$128  (via drill 0.3)
  Top 0.2: v24.7,9.5 26.17,9.5 J12.16
  Bottom 0.2: v24.7,9.5 26.05,8.15 J11.65 27.88,7.8 J11.66 27.88,7.4 | 27.88,7.4 J11.68 | J11.67 27.88,7.4

### Text on the board
tPlace: A7 | A0 | GND | A8 | A15 | C0 | C15 | GND | 12 | 13 | D8 | D7 | GND | C7 | C8 | GND | 4 | 5 | GND | D15 | D0 | GND | B15 | B8 | B0 | B7 | GND
bPlace: LESION-64-128-256 | CERN OHL1.2 | (C) JPN | MIT 2019